# Altium schematic sheet Sheet3.SchDoc
size A
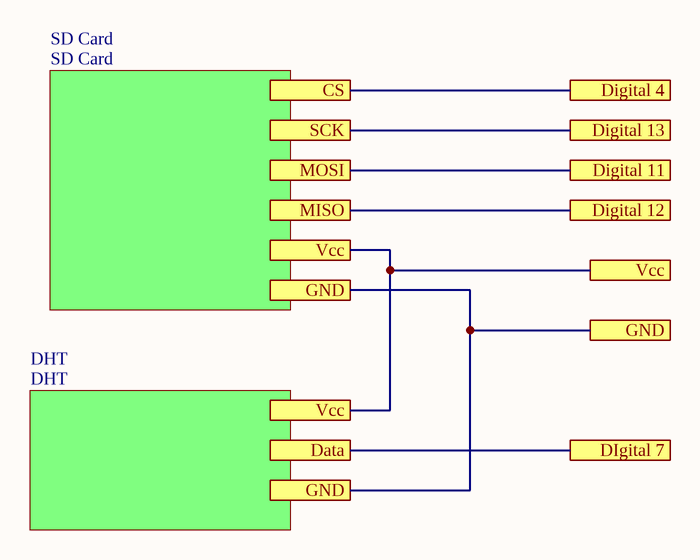
[diagram p0: Sheet3.SchDoc]

## Sub-sheets
DHT = DHT: no entries
SD Card = SD Card: no entries

## Ports
CS, Data, Digital 4, DIgital 7, Digital 11, Digital 12, Digital 13, GND, MISO, MOSI, SCK, Vcc

## Nets
CS: port CS, port Digital 4
Data: port Data, port DIgital 7
Digital 11: port MOSI, port Digital 11
Digital 12: port MISO, port Digital 12
Digital 13: port SCK, port Digital 13